# Altium schematic sheet Magnetic Sensor.SchDoc
size A; SheetNumber: 2; SheetTotal: 2
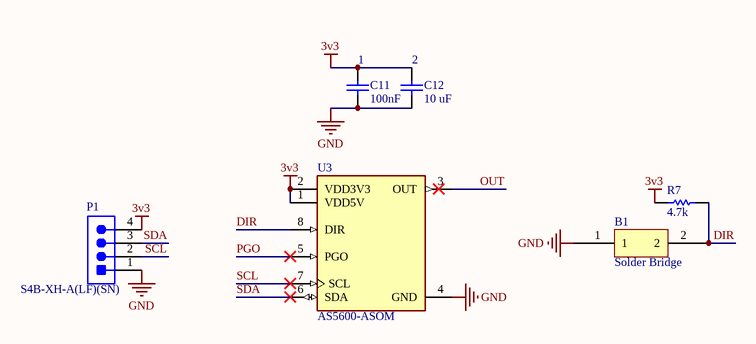
[diagram p0: Magnetic Sensor.SchDoc]

## Parts
B1  Solder Bridge  [Solder Bridge]
C11  100nF  [0402CAP]
C12  10 uF  [CAPC2013X140X50LL20T25]
P1  S4B-XH-A(LF)(SN)  [JST-S4B-XH-A(LF)(SN)_V]
R7  4.7k  [RESC1005X40X25LL05T05]
U3  AS5600-ASOM  [SOIC127P600X175-8N]

## Nets
3v3: C11.2 C12.2 P1.4 R7.1 U3.1(VDD5V) U3.2(VDD3V3)
GND: B1.1 C11.1 C12.1 P1.1 U3.4(GND)
DIR: B1.2 R7.2 U3.8(DIR)
OUT: U3.3(OUT)
PGO: U3.5(PGO)
SCL: P1.2 U3.7(SCL)
SDA: P1.3 U3.6(SDA)

## Notes on the sheet
- (near C11) 1
- (near C12) 2

## Library data of the parts
C11 = 04023D104KAT2A: Supplier 1: Digi-Key; Supplier Part Number 1: 478-7869-1-ND
C12 = 0805ZC106KAT2A: Manufacturer: AVX Interconnect / Elco; Part Number: 0805ZC106KAT2A; Supplier 1: Future Electronics; Supplier Part Number 1: 2116198
P1 = S4B-XH-A(LF)(SN): Male Header, Pitch 2.5 mm, 1 x 4 Position, Height 6.1 mm, Tail Length 3.4 mm, -25 to 85 degC, RoHS, Bulk; PackageReference: S4B-XH-A(LF)(SN); ComponentLink1Description: Manufacturer URL; DatasheetVersion: May-16; ComponentLink2Description: Datasheet; ComponentLink2URL: http://www.jst-mfg.com/product/pdf/eng/eXH.pdf; ComponentLink1URL: http://www.jst.com/home2.html; PackageDescription: Male Header, Pitch 2.5 mm, 1 x 4 Position, Height 6.1 mm, Tail Length 3.4 mm; Supplier 1: Digi-Key; Supplier Part Number 1: 455-2243-ND
R7 = ERJ-2RKF4701X: Chip Resistor, 4.7 KOhm, +/- 1%, 0.1 W, -55 to 155 degC, 0402 (1005 Metric), RoHS, Tape and Reel; Voltage Rating: 50 V; Case\/Package: 0402; Power Rating: 100 mW; Height: 0.35 mm; Mounting Technology: Surface Mount; REACH SVHC: Yes; Resistance: 4.7 KOhm; Max Operating Temperature: 155 degC; ComponentLink1Description: Manufacturer URL; ComponentLink2Description: Datasheet; Pins: 2; PackageReference: 0402; Tolerance: 1%; Case Code (Imperial): 0402; Length: 1 mm; PackageDescription: 2-Pin Surface Mount Device, Body 1 x 0.5 mm; PartNumber: ERJ-2RKF4701X; RoHSCompliant: true; Package Quantity: 1; Radiation Hardening: No; DatasheetVersion: 04/2015; Width: 0.5 mm; Case Code (Metric): 1005; Mount: Surface Mount; ComponentLink1URL: http://www.panasonic.com/; Min Operating Temperature: -55 degC; Packaging: Cut Tape; ComponentLink2URL: http://industrial.panasonic.com/cdbs/www-data/pdf/RDA0000/AOA0000C86.pdf; Supplier 1: Digi-Key; Supplier Part Number 1: P4.70KLCT-ND
U3 = AS5600-ASOM: SENSOR ANGLE 360DEG SMD; Sensing Method: Hall Effect; Termination: SMD/SMT; Min Operating Temperature: -40°C; Mount: Surface Mount; Lead Free: Lead Free; Max Operating Temperature: 125°C; Supplier 1: Digi-Key; Supplier Part Number 1: AS5600-ASOMCT-ND